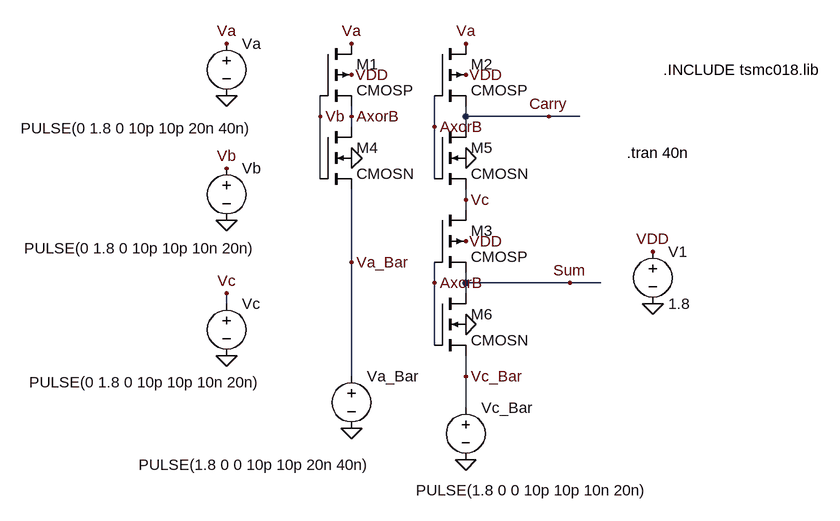
[diagram p0: schematic low_power_adder.asc]
low_power_adder.asc, the LTspice schematic file:
Version 4
SHEET 1 880 1108
WIRE -144 160 -144 128
WIRE -96 160 -96 144
WIRE 80 160 80 144
WIRE 208 160 80 160
WIRE 256 160 208 160
WIRE -96 176 -96 160
WIRE 32 176 32 128
WIRE 80 176 80 160
WIRE -144 256 -144 160
WIRE 32 256 32 176
WIRE 80 288 80 272
WIRE 80 304 80 288
WIRE -96 384 -96 272
WIRE 32 416 32 384
WIRE 80 416 80 400
WIRE 240 416 80 416
WIRE 288 416 240 416
WIRE 80 432 80 416
WIRE -288 448 -288 432
WIRE 32 512 32 416
WIRE -96 560 -96 384
WIRE 80 560 80 528
WIRE 80 608 80 560
FLAG -288 128 0
FLAG -288 320 0
FLAG -288 528 0
FLAG 80 480 0
FLAG 80 224 0
FLAG -96 224 0
FLAG 368 448 0
FLAG 368 368 VDD
FLAG 80 96 VDD
FLAG -96 96 VDD
FLAG 80 352 VDD
FLAG 80 288 Vc
FLAG -288 432 Vc
FLAG -144 160 Vb
FLAG -288 240 Vb
FLAG -96 48 Va
FLAG 80 48 Va
FLAG -288 48 Va
FLAG -96 160 AxorB
FLAG 32 176 AxorB
FLAG 32 416 AxorB
FLAG 208 160 Carry
FLAG 240 416 Sum
FLAG -96 640 0
FLAG 80 688 0
FLAG -96 384 Va_Bar
FLAG 80 560 Vc_Bar
SYMBOL cmosp -144 48 R0
SYMATTR InstName M1
SYMATTR Value2 l=180n w=1200n
SYMBOL cmosp 32 48 R0
SYMATTR InstName M2
SYMATTR Value2 l=180n w=400n
SYMBOL cmosp 32 304 R0
SYMATTR InstName M3
SYMATTR Value2 l=180n w=400n
SYMBOL cmosn -144 176 R0
SYMATTR InstName M4
SYMATTR Value2 l=180n w=400n
SYMBOL cmosn 32 176 R0
SYMATTR InstName M5
SYMATTR Value2 l=180n w=400n
SYMBOL cmosn 32 432 R0
SYMATTR InstName M6
SYMATTR Value2 l=180n w=400n
SYMBOL voltage -288 32 R0
WINDOW 123 0 0 Left 0
WINDOW 39 0 0 Left 0
WINDOW 3 -317 146 Left 2
SYMATTR Value PULSE(0 1.8 0 10p 10p 20n 40n)
SYMATTR InstName Va
SYMBOL voltage -288 224 R0
WINDOW 3 -312 139 Left 2
WINDOW 123 0 0 Left 0
WINDOW 39 0 0 Left 0
SYMATTR Value PULSE(0 1.8 0 10p 10p 10n 20n)
SYMATTR InstName Vb
SYMBOL voltage -288 432 R0
WINDOW 3 -304 137 Left 2
WINDOW 123 0 0 Left 0
WINDOW 39 0 0 Left 0
SYMATTR Value PULSE(0 1.8 0 10p 10p 10n 20n)
SYMATTR InstName Vc
SYMBOL voltage 368 352 R0
WINDOW 123 0 0 Left 0
WINDOW 39 0 0 Left 0
SYMATTR InstName V1
SYMATTR Value 1.8
SYMBOL voltage -96 544 R0
WINDOW 3 30 152 Right 2
WINDOW 123 0 0 Left 0
WINDOW 39 0 0 Left 0
SYMATTR Value PULSE(1.8 0 0 10p 10p 20n 40n)
SYMATTR InstName Va_Bar
SYMBOL voltage 80 592 R0
WINDOW 3 281 143 Right 2
WINDOW 123 0 0 Left 0
WINDOW 39 0 0 Left 0
SYMATTR Value PULSE(1.8 0 0 10p 10p 10n 20n)
SYMATTR InstName Vc_Bar
TEXT 384 88 Left 2 !.INCLUDE tsmc018.lib
TEXT 328 216 Left 2 !.tran 40n

The netlist it stands for:
* low_power_adder.asc
M1 Va Vb AxorB VDD CMOSP l=180n w=1200n
M2 Va AxorB Carry VDD CMOSP l=180n w=400n
M3 Vc AxorB Sum VDD CMOSP l=180n w=400n
M4 AxorB Vb Va_Bar 0 CMOSN l=180n w=400n
M5 Carry AxorB Vc 0 CMOSN l=180n w=400n
M6 Sum AxorB Vc_Bar 0 CMOSN l=180n w=400n
Va Va 0 PULSE(0 1.8 0 10p 10p 20n 40n)
Vb Vb 0 PULSE(0 1.8 0 10p 10p 10n 20n)
Vc Vc 0 PULSE(0 1.8 0 10p 10p 10n 20n)
V1 VDD 0 1.8
Va_Bar Va_Bar 0 PULSE(1.8 0 0 10p 10p 20n 40n)
Vc_Bar Vc_Bar 0 PULSE(1.8 0 0 10p 10p 10n 20n)
.model NMOS NMOS
.model PMOS PMOS
.lib standard.mos
.INCLUDE tsmc018.lib
.tran 40n
.backanno
.end